# EAGLE schematic front-end-eval-boards (EAGLE 9.2.2)

## Sheet 1 of 7: Power
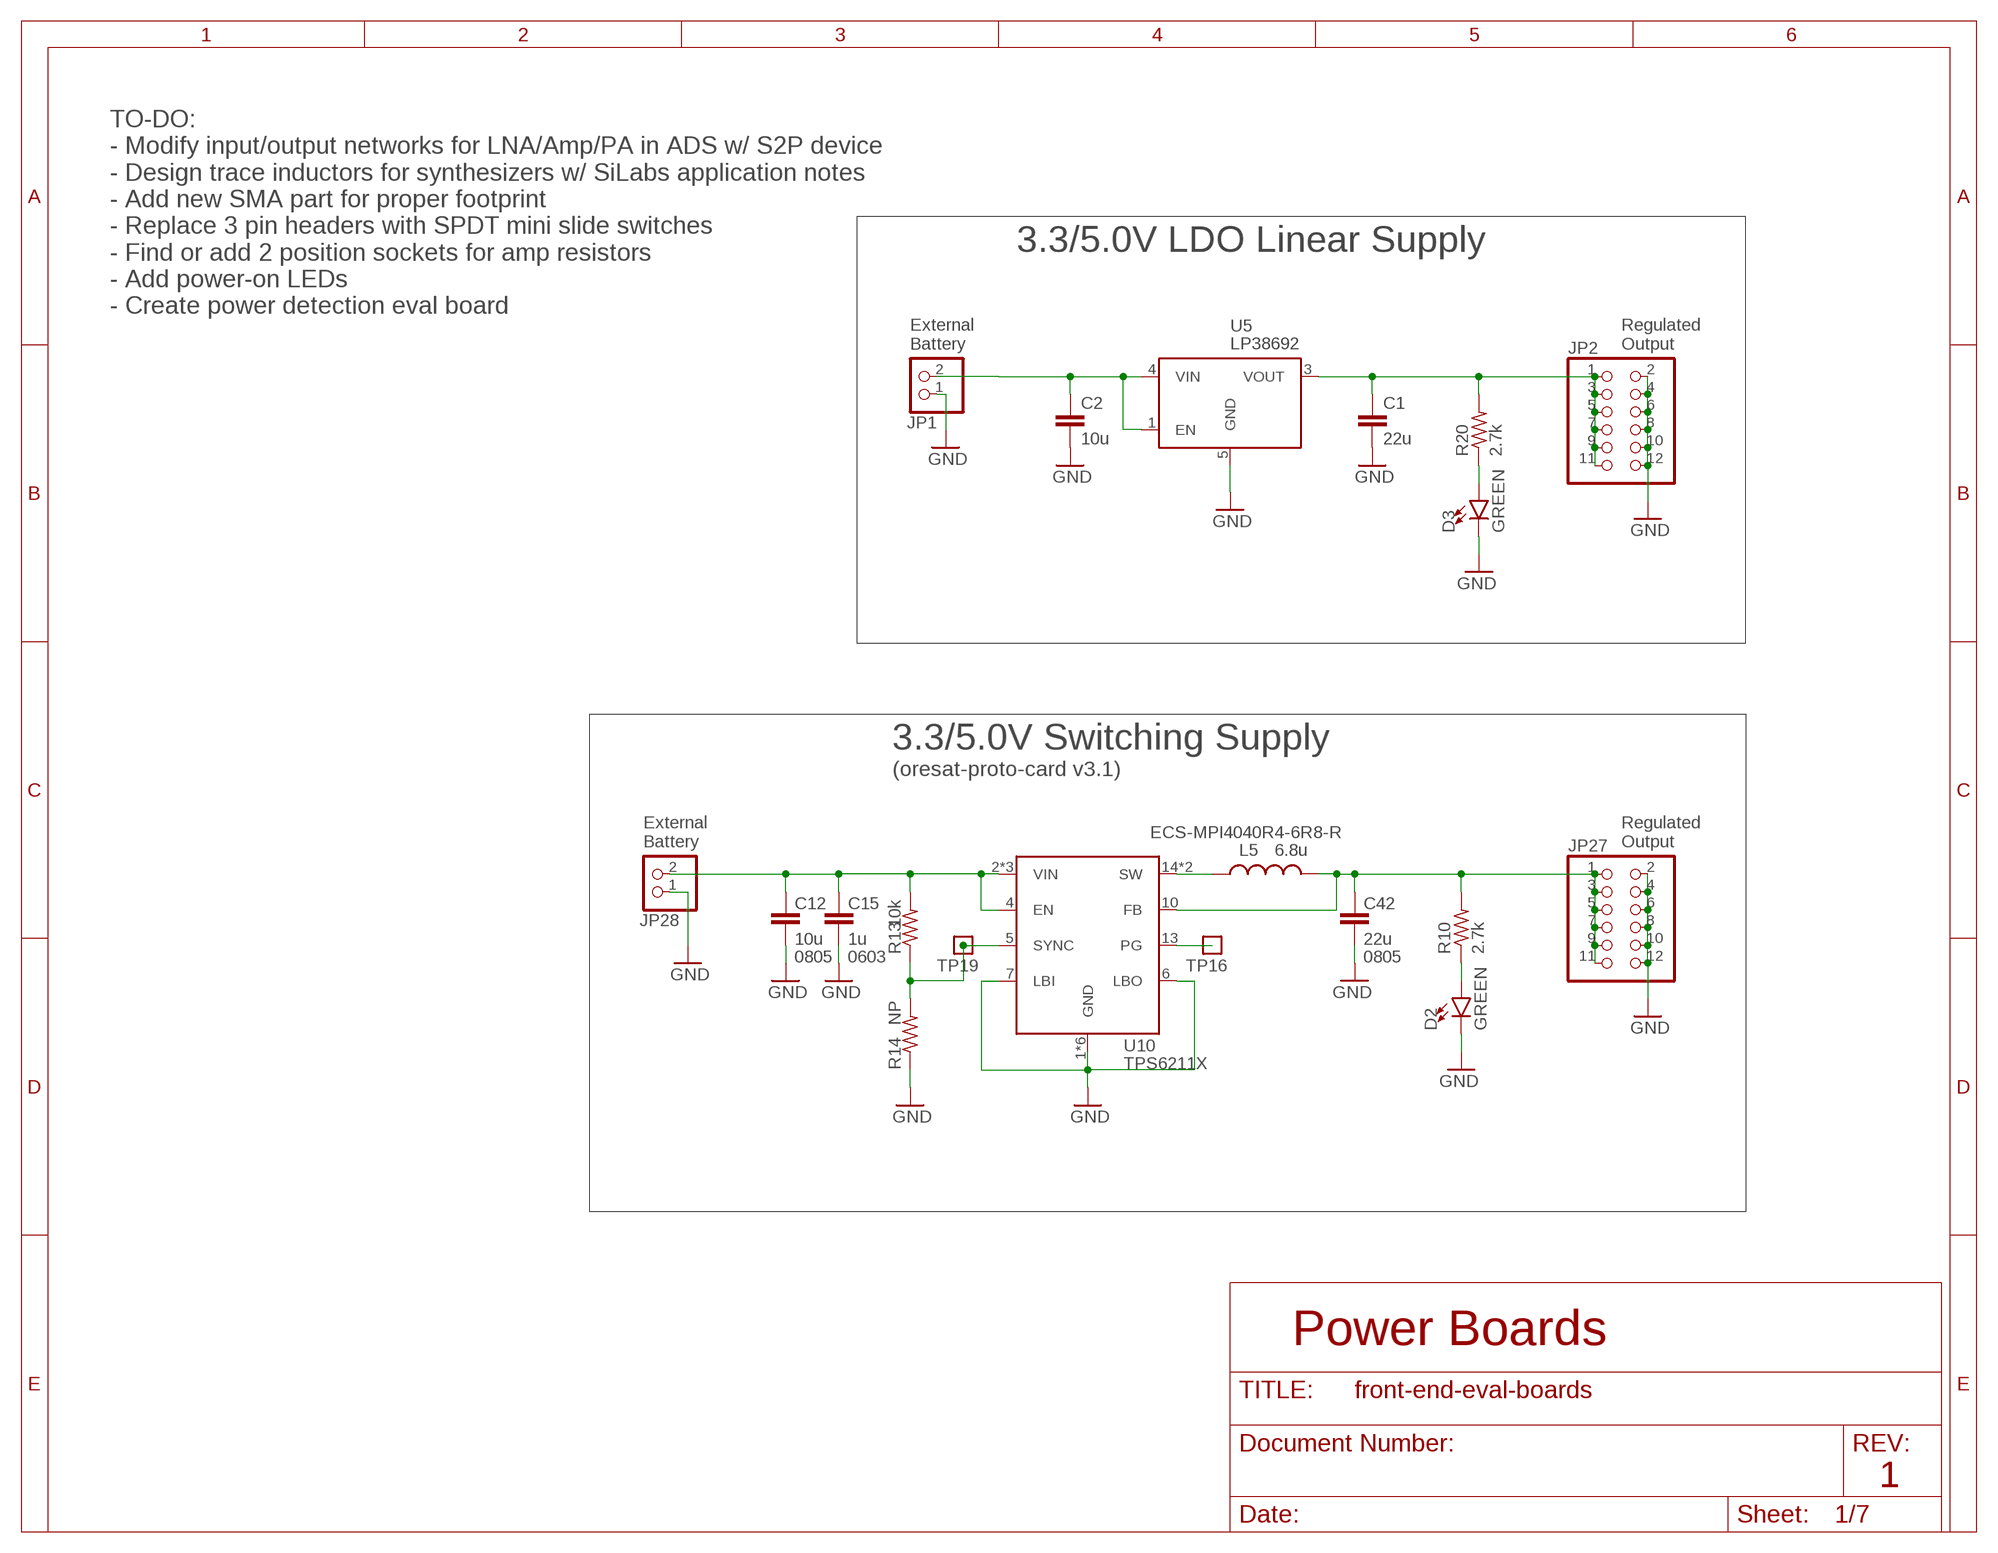
[diagram p0: schematic, sheet 1]

### Parts
C1  22u  C-EUC0603  [C0603]
C2  10u  C-EUC0603  [C0603]
C12  10u  C-EU0805-B-NOSILK  [.0805-B-NOSILK]
C15  1u  C-EU0603-B-NOSILK  [.0603-B-NOSILK]
C42  22u  C-EU0805-B-NOSILK  [.0805-B-NOSILK]
D2  GREEN  LED-GREEN0603  [LED-0603]
D3  GREEN  LED-GREEN0603  [LED-0603]
JP1  PINHD-1X2  [1X02]
JP2  PINHD-2X6  [2X06]
JP27  PINHD-2X6  [2X06]
JP28  PINHD-1X2  [1X02]
L5  6.8u  L-ECS-MPI4040  [ECS-MPI4040]
R10  2.7k  R-US_0402-B-NOSILK  [.0402-B-NOSILK]
R13  10k  R-US_0402-B-NOSILK  [.0402-B-NOSILK]
R14  NP  R-US_0402-B-NOSILK  [.0402-B-NOSILK]
R20  2.7k  R-US_0402-B-NOSILK  [.0402-B-NOSILK]
TP16  TEST-POINT  [2MM-TEST-POINT]
TP19  TEST-POINT  [2MM-TEST-POINT]
U5  LP38692  [SOT223-5]
U10  TPS6211X  [S-PVQFN-16]

### Nets
GND: C1.2 C2.2 C12.2 C15.2 C42.2 D2.C D3.C JP1.1 JP2.2 JP2.4 JP2.6 JP2.8 JP2.10 JP2.12 JP27.2 JP27.4 JP27.6 JP27.8 JP27.10 JP27.12 JP28.1 R14.1 U5.5(GND) U10.1(GND) U10.6(LBO) U10.7(LBI) U10.9(GND) U10.11(GND) U10.12(GND) U10.16(GND) U10.PAD(GND) ; also sheet 2,3,4,5,6,7
N$77: C2.1 JP1.2 U5.1(EN) U5.4(VIN)
N$78: D3.A R20.1
N$79: C42.1 JP27.1 JP27.3 JP27.5 JP27.7 JP27.9 JP27.11 L5.2 R10.2 U10.10(FB)
N$80: C12.1 C15.1 JP28.2 R13.2 U10.2(VIN) U10.3(VIN) U10.4(EN) U10.8(VIN)
N$89: C1.1 JP2.1 JP2.3 JP2.5 JP2.7 JP2.9 JP2.11 R20.2 U5.3(VOUT)
N$271: D2.A R10.1
TPS62111-PG: TP16.1 U10.13(PG)
TPS62111-SYNC: R13.1 R14.2 TP19.1 U10.5(SYNC)
TPS62111_SW: L5.1 U10.14(SW) U10.15(SW)

### Notes on the sheet
- TO-DO:
  - Modify input/output networks for LNA/Amp/PA in ADS w/ S2P device
  - Design trace inductors for synthesizers w/ SiLabs application notes
  - Add new SMA part for proper footprint
  - Replace 3 pin headers with SPDT mini slide switches
  - Find or add 2 position sockets for amp resistors
  - Add power-on LEDs
  - Create power detection eval board
- 3.3/5.0V LDO Linear Supply
- External
  Battery
- Regulated
  Output
- 3.3/5.0V Switching Supply
- (oresat-proto-card v3.1)
- ECS-MPI4040R4-6R8-R
- External
  Battery
- Regulated
  Output
- 0805 | 0603 | 0805
- Power Boards
- 1

## Sheet 2 of 7: RF Synthesizers
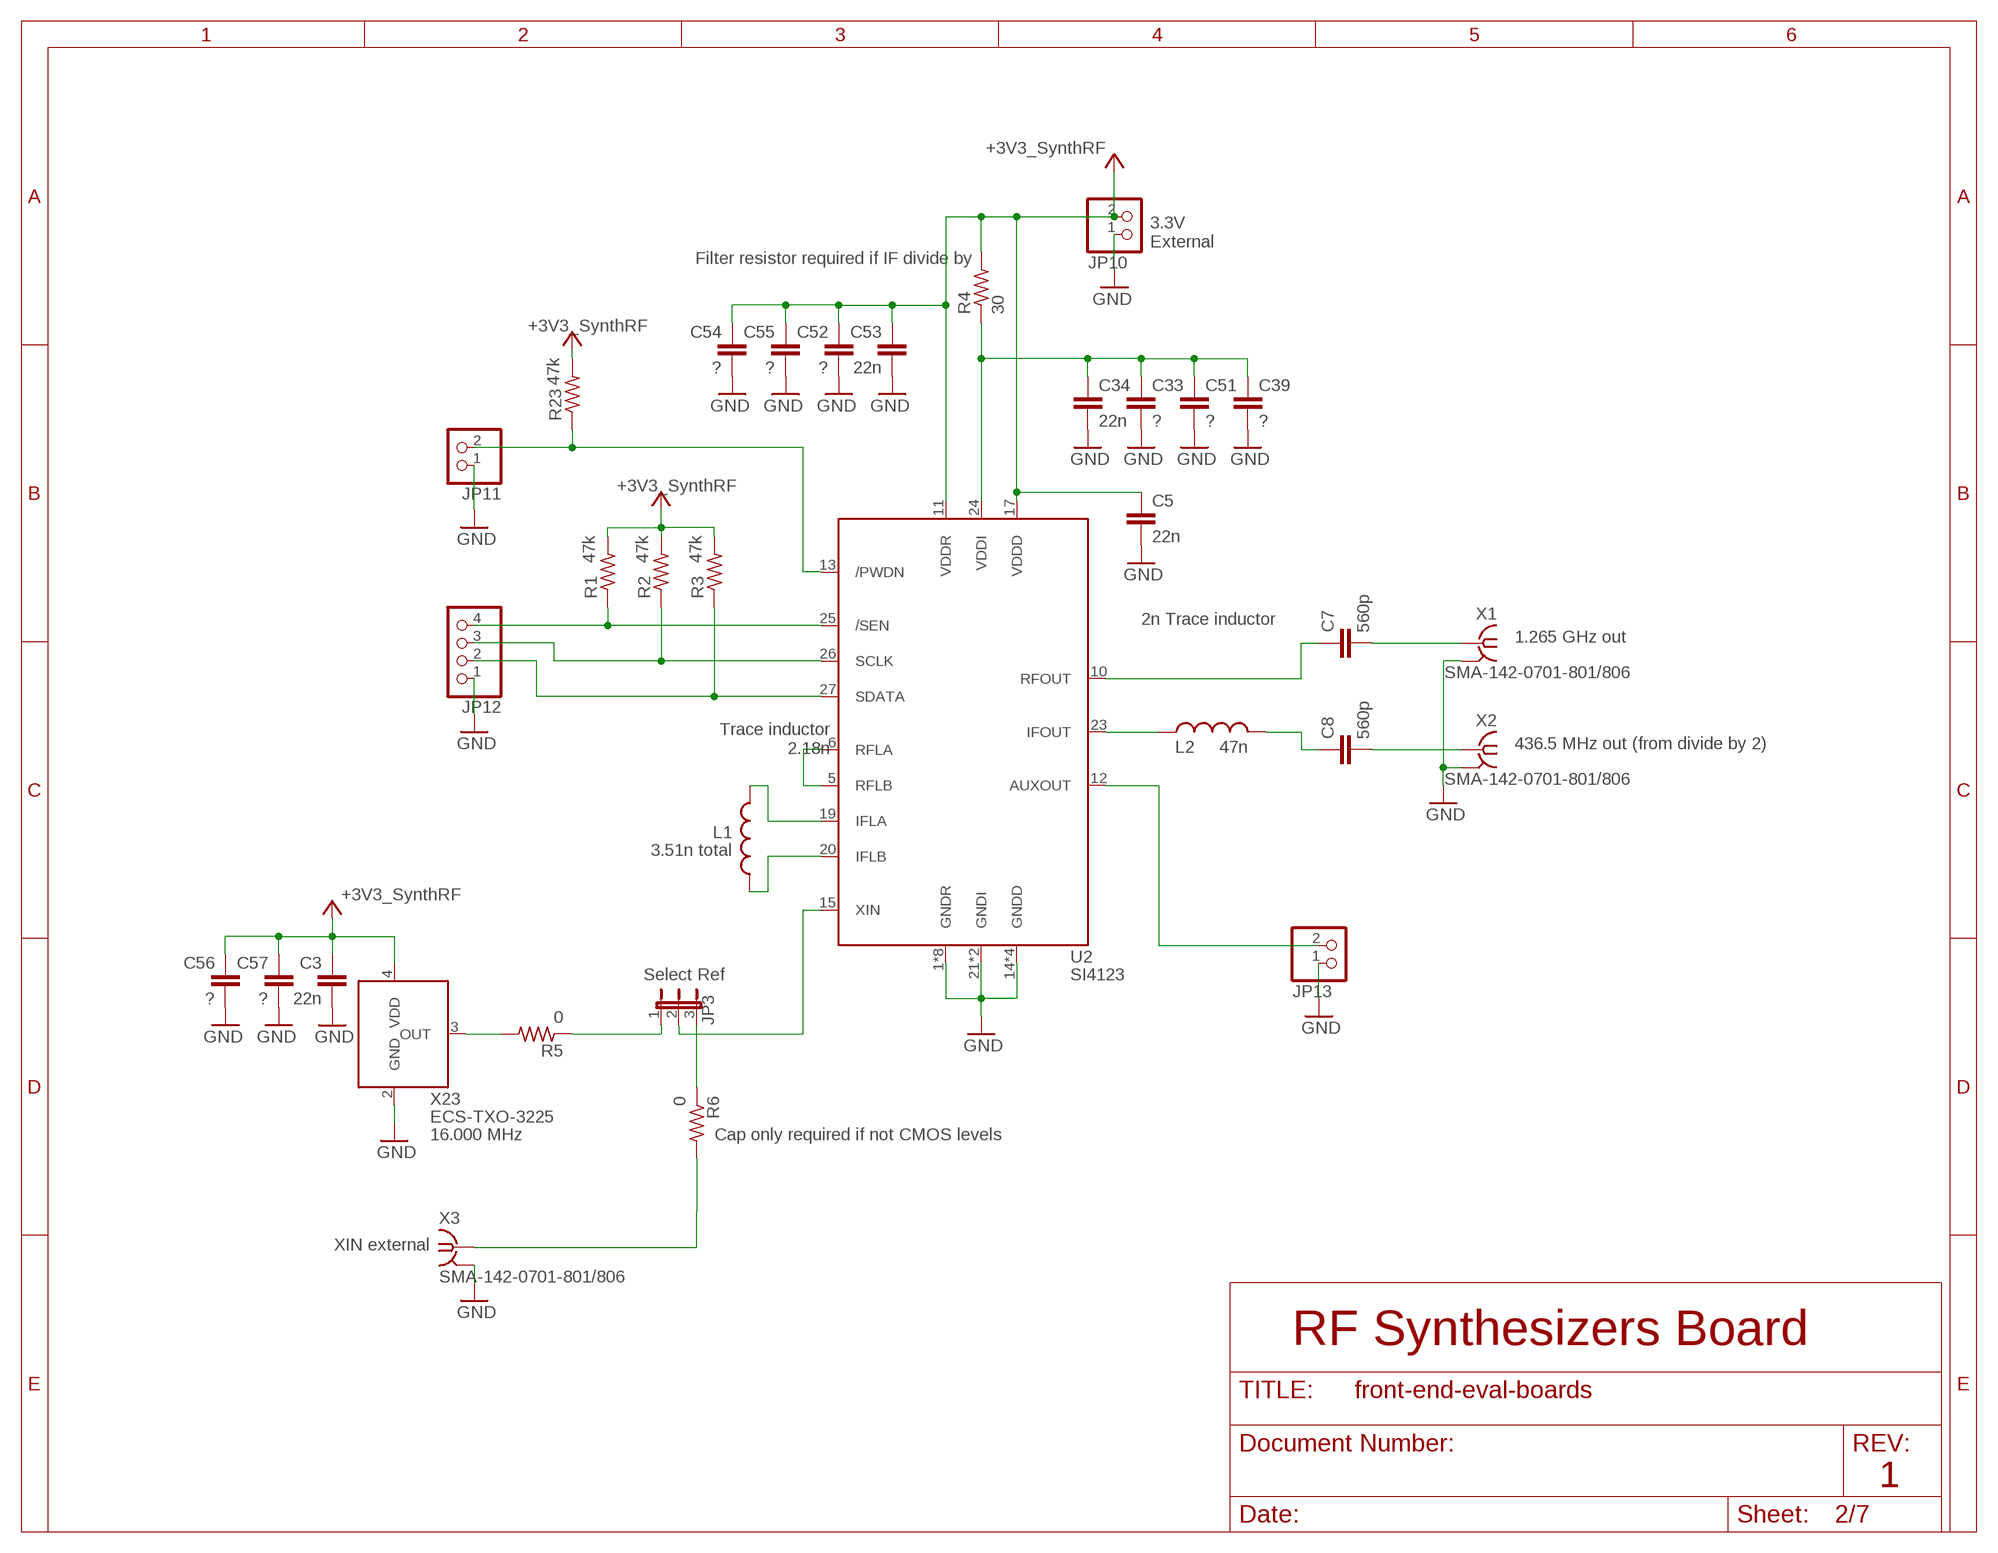
[diagram p1: schematic, sheet 2]

### Parts
C3  22n  C-EUC0603  [C0603]
C5  22n  C-EUC0603  [C0603]
C7  560p  C-EUC0402  [C0402]
C8  560p  C-EUC0402  [C0402]
C33  ?  C-EUC0603  [C0603]
C34  22n  C-EUC0603  [C0603]
C39  ?  C-EUC0603  [C0603]
C51  ?  C-EUC0603  [C0603]
C52  ?  C-EUC0603  [C0603]
C53  22n  C-EUC0603  [C0603]
C54  ?  C-EUC0603  [C0603]
C55  ?  C-EUC0603  [C0603]
C56  ?  C-EUC0603  [C0603]
C57  ?  C-EUC0603  [C0603]
JP3  JP2E  [JP2]
JP10  PINHD-1X2  [1X02]
JP11  PINHD-1X2  [1X02]
JP12  PINHD-1X4  [1X04]
JP13  PINHD-1X2  [1X02]
L1  3.51n total  L-USL0201  [L0201]
L2  47n  L-USL0201  [L0201]
R1  47k  R-US_R0402  [R0402]
R2  47k  R-US_R0402  [R0402]
R3  47k  R-US_R0402  [R0402]
R4  30  R-US_R0805  [R0805]
R5  0  R-US_R0402  [R0402]
R6  0  R-US_R0402  [R0402]
R23  47k  R-US_R0402  [R0402]
U2  SI4123  [QFN28-5X5-WITH-CENTER-PAD]
X1  SMA-142-0701-801/806  [J502-ND-142-0701-801/806]
X2  SMA-142-0701-801/806  [J502-ND-142-0701-801/806]
X3  SMA-142-0701-801/806  [J502-ND-142-0701-801/806]
X23  ECS-TXO-3225  [3.2X2.5]

### Nets
+3V3: C3.1 C5.1 C52.1 C53.1 C54.1 C55.1 C56.1 C57.1 JP10.2 R1.2 R2.2 R3.2 R4.2 R23.2 U2.11(VDDR) U2.17(VDDD) X23.4(VDD) ; supply symbol labelled +3V3_SynthRF ; also sheet 3
GND: C3.2 C5.2 C33.2 C34.2 C39.2 C51.2 C52.2 C53.2 C54.2 C55.2 C56.2 C57.2 JP10.1 JP11.1 JP12.1 JP13.1 U2.1(GNDR) U2.2(GNDR) U2.3(GNDR) U2.4(GNDR) U2.7(GNDR) U2.8(GNDR) U2.9(GNDR) U2.14(GNDD) U2.16(GNDD) U2.18(GNDD) U2.21(GNDI) U2.22(GNDI) U2.28(GNDR) U2.PAD(GNDD) X1.G@1 X1.G@2 X1.G@3 X1.G@4 X2.G@1 X2.G@2 X2.G@3 X2.G@4 X3.G@1 X3.G@2 X3.G@3 X3.G@4 X23.2(GND) ; also sheet 1,3,4,5,6,7
N$1: JP3.2 U2.15(XIN)
N$2: U2.5(RFLB) U2.6(RFLA)
N$3: L1.1 U2.19(IFLA)
N$4: JP11.2 R23.1 U2.13(/PWDN)
N$5: JP12.4 R1.1 U2.25(/SEN)
N$6: JP12.3 R2.1 U2.26(SCLK)
N$7: JP12.2 R3.1 U2.27(SDATA)
N$8: JP13.2 U2.12(AUXOUT)
N$9: JP3.1 R5.1
N$10: R6.2 X3.1
N$12: L1.2 U2.20(IFLB)
N$13: L2.1 U2.23(IFOUT)
N$14: C7.1 U2.10(RFOUT)
N$16: C7.2 X1.1
N$17: C8.1 L2.2
N$18: C8.2 X2.1
N$20: R5.2 X23.3(OUT)
N$21: JP3.3 R6.1
N$93: C33.1 C34.1 C39.1 C51.1 R4.1 U2.24(VDDI)

### Notes on the sheet
- 3.3V
  External
- Filter resistor required if IF divide by
- 2n Trace inductor
- 1.265 GHz out
- Trace inductor
        2.18n
- 436.5 MHz out (from divide by 2)
- Select Ref
- 16.000 MHz | Cap only required if not CMOS levels
- XIN external
- RF Synthesizers Board
- 1

## Sheet 3 of 7: IF Synthesizer
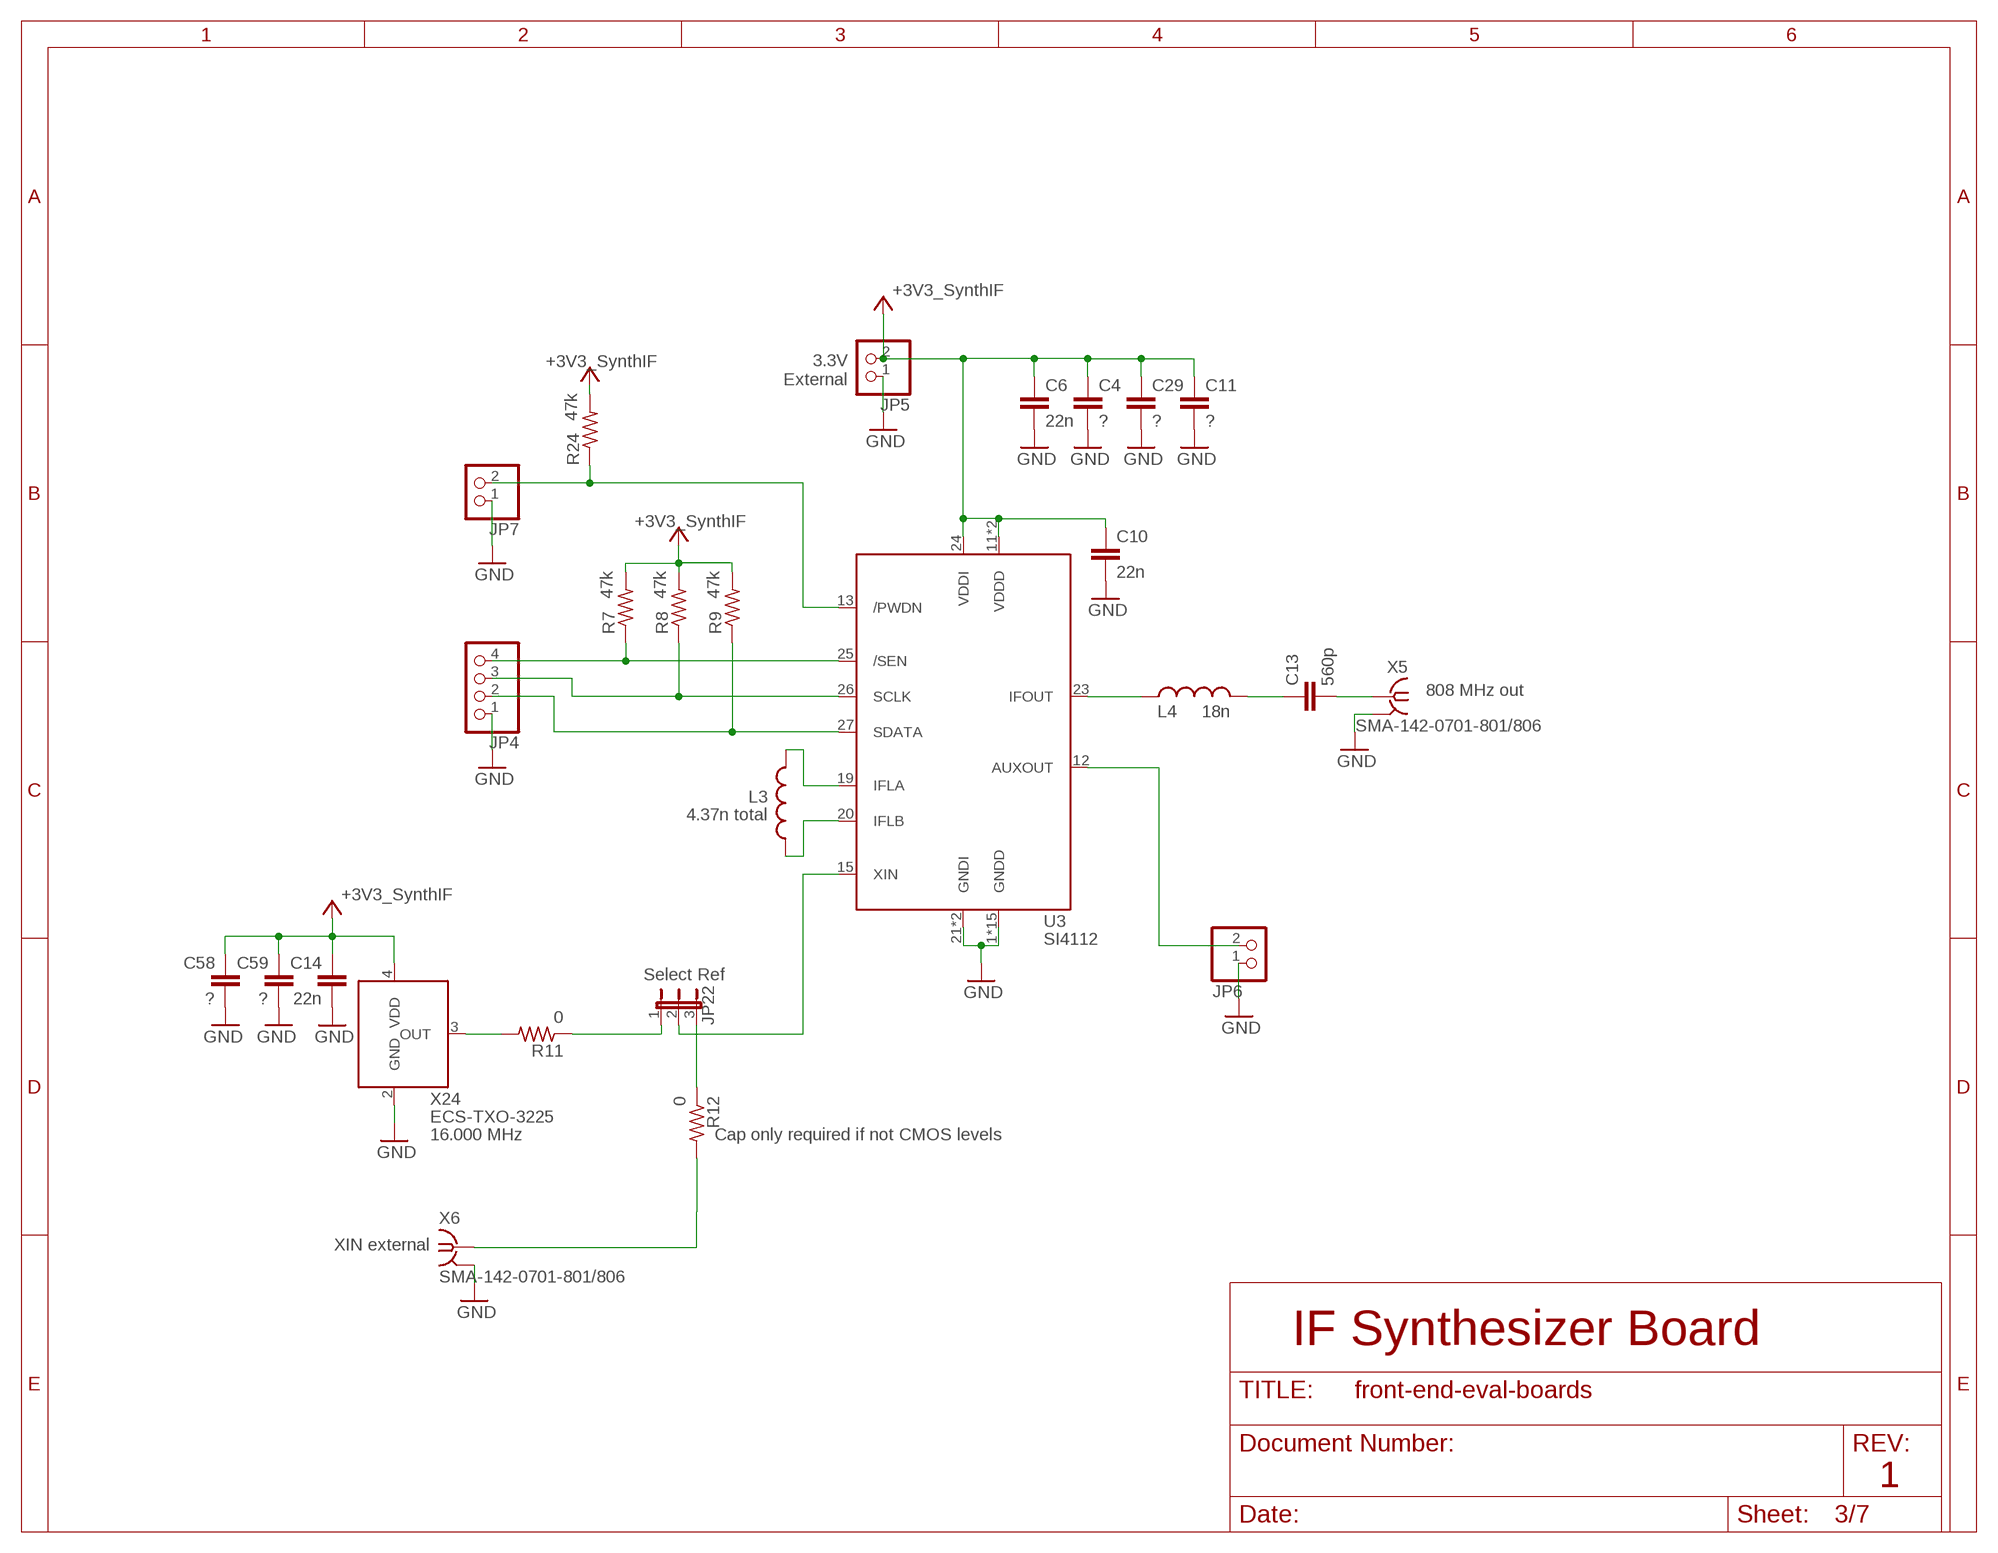
[diagram p2: schematic, sheet 3]

### Parts
C4  ?  C-EUC0603  [C0603]
C6  22n  C-EUC0603  [C0603]
C10  22n  C-EUC0603  [C0603]
C11  ?  C-EUC0603  [C0603]
C13  560p  C-EUC0402  [C0402]
C14  22n  C-EUC0603  [C0603]
C29  ?  C-EUC0603  [C0603]
C58  ?  C-EUC0603  [C0603]
C59  ?  C-EUC0603  [C0603]
JP4  PINHD-1X4  [1X04]
JP5  PINHD-1X2  [1X02]
JP6  PINHD-1X2  [1X02]
JP7  PINHD-1X2  [1X02]
JP22  JP2E  [JP2]
L3  4.37n total  L-USL0201  [L0201]
L4  18n  L-USL0201  [L0201]
R7  47k  R-US_R0402  [R0402]
R8  47k  R-US_R0402  [R0402]
R9  47k  R-US_R0402  [R0402]
R11  0  R-US_R0402  [R0402]
R12  0  R-US_R0402  [R0402]
R24  47k  R-US_R0402  [R0402]
U3  SI4112  [QFN28-5X5-WITH-CENTER-PAD]
X5  SMA-142-0701-801/806  [J502-ND-142-0701-801/806]
X6  SMA-142-0701-801/806  [J502-ND-142-0701-801/806]
X24  ECS-TXO-3225  [3.2X2.5]

### Nets
+3V2: C14.1 C58.1 C59.1 X24.4(VDD) ; supply symbol labelled +3V3_SynthIF
+3V3: C4.1 C6.1 C10.1 C11.1 C29.1 JP5.2 R7.2 R8.2 R9.2 R24.2 U3.11(VDDD) U3.17(VDDD) U3.24(VDDI) ; supply symbol labelled +3V3_SynthIF ; also sheet 2
GND: C4.2 C6.2 C10.2 C11.2 C14.2 C29.2 C58.2 C59.2 JP4.1 JP5.1 JP6.1 JP7.1 U3.1(GNDD) U3.2(GNDD) U3.3(GNDD) U3.4(GNDD) U3.5(GNDD) U3.6(GNDD) U3.7(GNDD) U3.8(GNDD) U3.9(GNDD) U3.10(GNDD) U3.14(GNDD) U3.16(GNDD) U3.18(GNDD) U3.21(GNDI) U3.22(GNDI) U3.28(GNDD) U3.PAD(GNDD) X5.G@1 X5.G@2 X5.G@3 X5.G@4 X6.G@1 X6.G@2 X6.G@3 X6.G@4 X24.2(GND) ; also sheet 1,2,4,5,6,7
N$15: L4.1 U3.23(IFOUT)
N$19: JP4.4 R7.1 U3.25(/SEN)
N$22: JP4.3 R8.1 U3.26(SCLK)
N$23: JP4.2 R9.1 U3.27(SDATA)
N$24: JP7.2 R24.1 U3.13(/PWDN)
N$25: JP6.2 U3.12(AUXOUT)
N$26: JP22.1 R11.1
N$27: R12.2 X6.1
N$29: JP22.2 U3.15(XIN)
N$30: L3.1 U3.19(IFLA)
N$31: L3.2 U3.20(IFLB)
N$35: C13.1 L4.2
N$36: C13.2 X5.1
N$37: R11.2 X24.3(OUT)
N$38: JP22.3 R12.1

### Notes on the sheet
- 3.3V
  External
- 808 MHz out
- Select Ref
- 16.000 MHz | Cap only required if not CMOS levels
- XIN external
- IF Synthesizer Board
- 1

## Sheet 4 of 7: LNAs / Amps
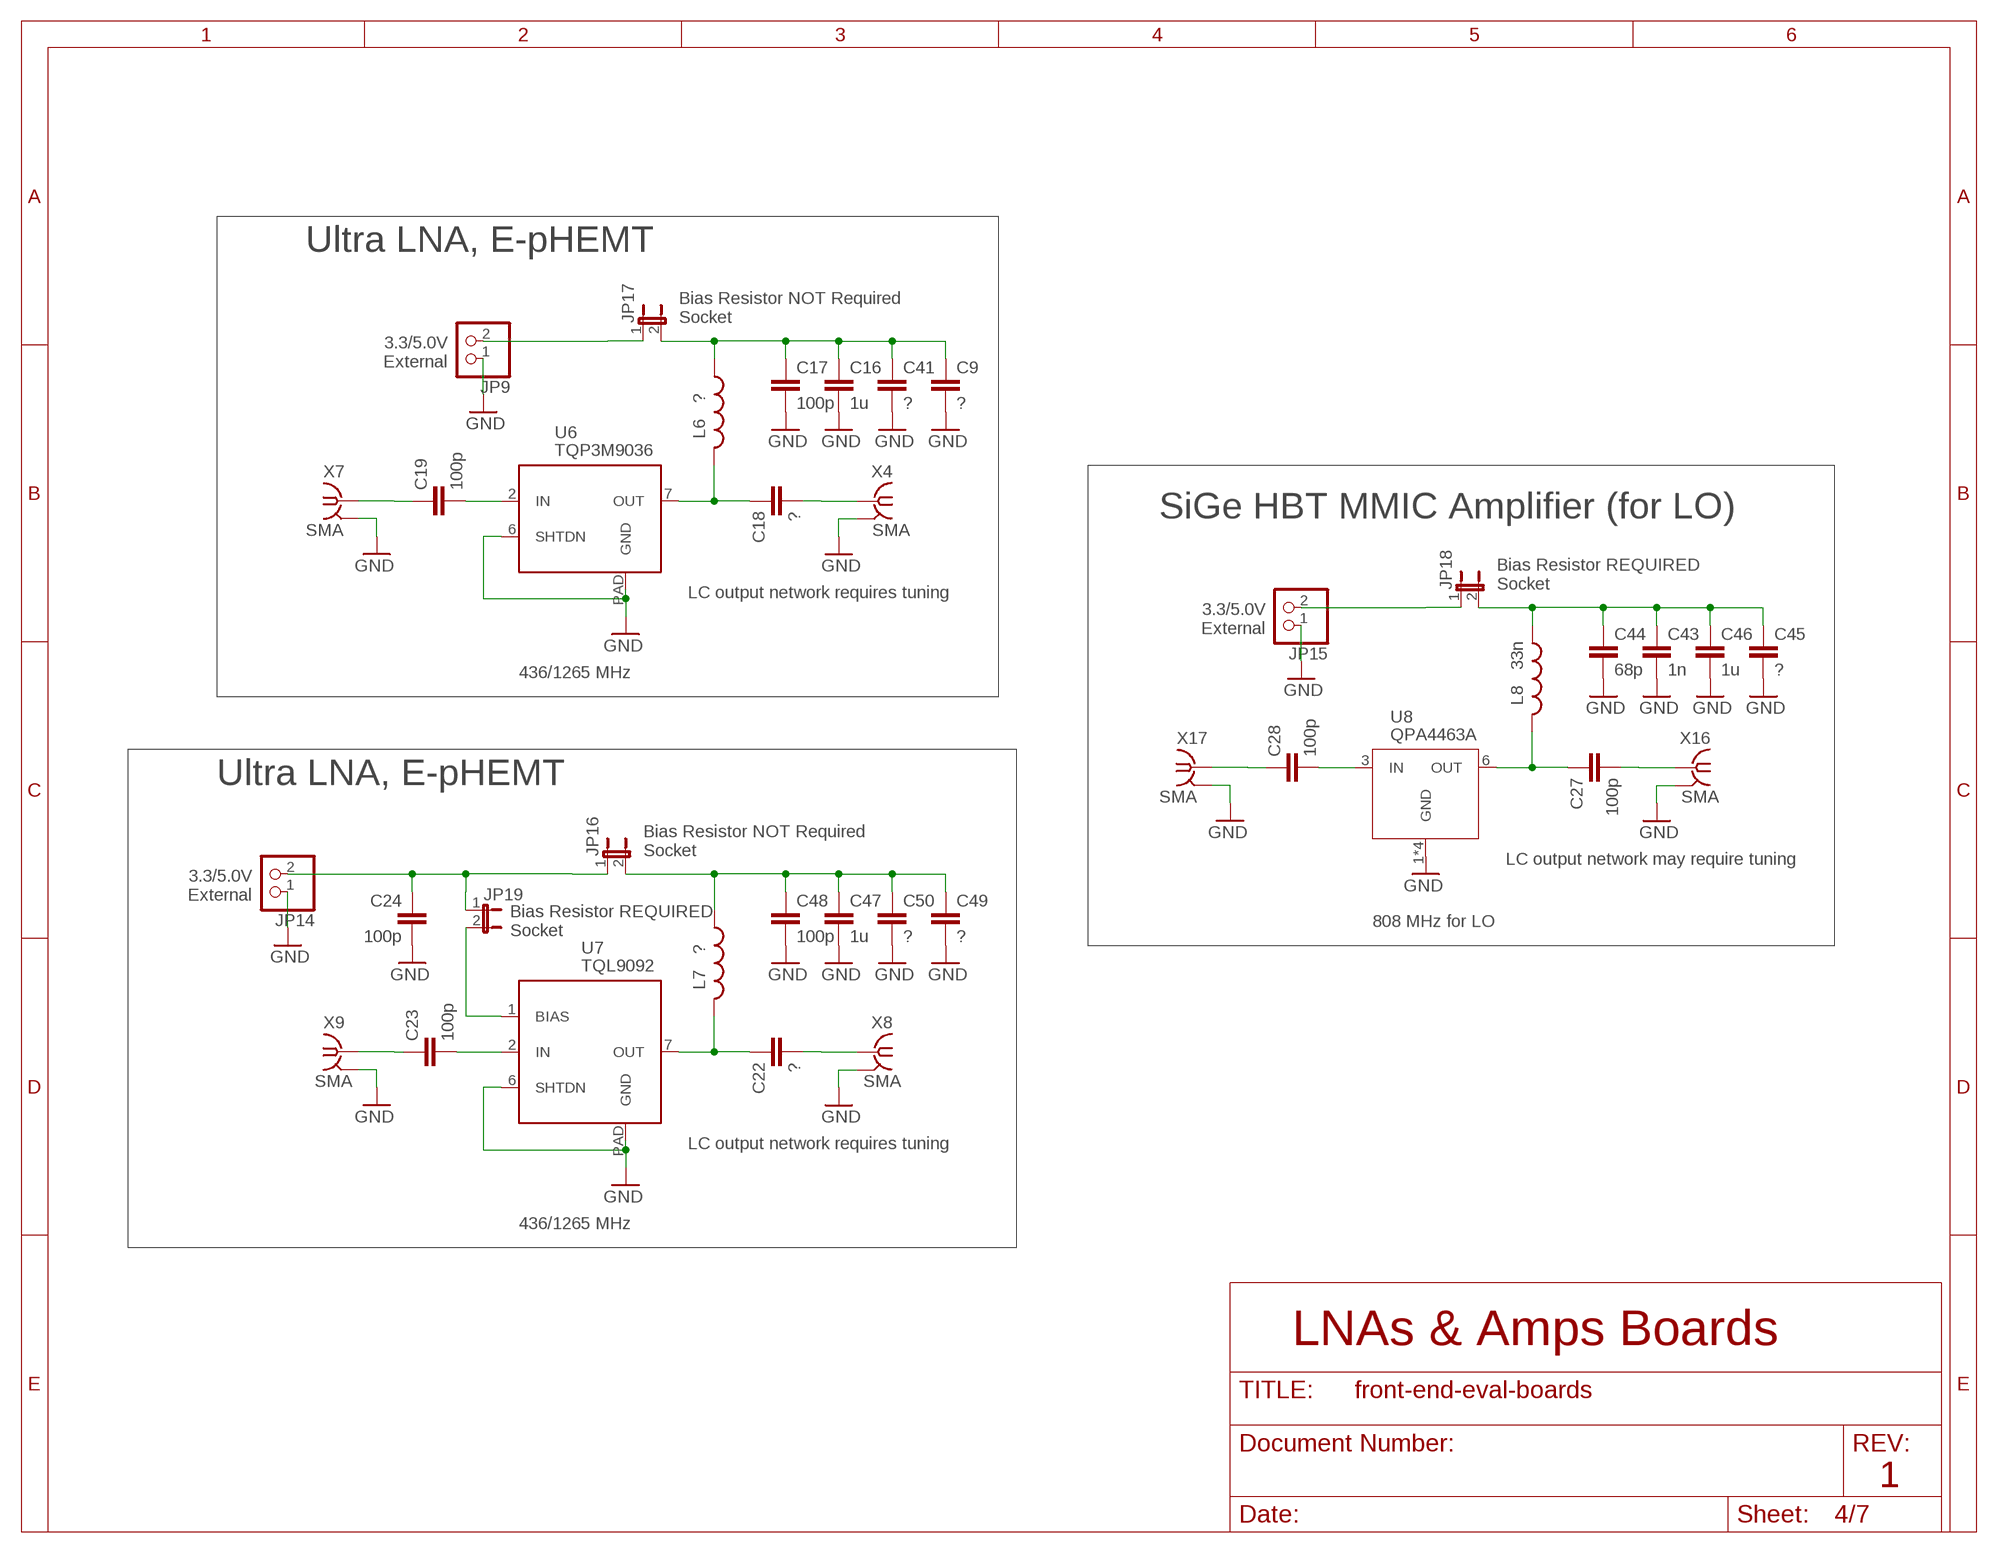
[diagram p3: schematic, sheet 4]

### Parts
C9  ?  C-EUC0603  [C0603]
C16  1u  C-EUC0603  [C0603]
C17  100p  C-EUC0603  [C0603]
C18  ?  C-EUC0603  [C0603]
C19  100p  C-EUC0603  [C0603]
C22  ?  C-EUC0603  [C0603]
C23  100p  C-EUC0603  [C0603]
C24  100p  C-EUC0603  [C0603]
C27  100p  C-EUC0603  [C0603]
C28  100p  C-EUC0603  [C0603]
C41  ?  C-EUC0603  [C0603]
C43  1n  C-EUC0603  [C0603]
C44  68p  C-EUC0603  [C0603]
C45  ?  C-EUC0603  [C0603]
C46  1u  C-EUC0603  [C0603]
C47  1u  C-EUC0603  [C0603]
C48  100p  C-EUC0603  [C0603]
C49  ?  C-EUC0603  [C0603]
C50  ?  C-EUC0603  [C0603]
JP9  PINHD-1X2  [1X02]
JP14  PINHD-1X2  [1X02]
JP15  PINHD-1X2  [1X02]
JP16  JP1E  [JP1]
JP17  JP1E  [JP1]
JP18  JP1E  [JP1]
JP19  JP1E  [JP1]
L6  ?  L-USL1812  [L1812]
L7  ?  L-USL1812  [L1812]
L8  33n  L-USL1812  [L1812]
U6  TQP3M9036  [DFN8-2X2-WITH-PAD]
U7  TQL9092  [DFN8-2X2-WITH-PAD]
U8  QPA4463A  [SOT363]
X4  SMA  SMA-142-0701-801/806  [J502-ND-142-0701-801/806]
X7  SMA  SMA-142-0701-801/806  [J502-ND-142-0701-801/806]
X8  SMA  SMA-142-0701-801/806  [J502-ND-142-0701-801/806]
X9  SMA  SMA-142-0701-801/806  [J502-ND-142-0701-801/806]
X16  SMA  SMA-142-0701-801/806  [J502-ND-142-0701-801/806]
X17  SMA  SMA-142-0701-801/806  [J502-ND-142-0701-801/806]

### Nets
GND: C9.2 C16.2 C17.2 C24.2 C41.2 C43.2 C44.2 C45.2 C46.2 C47.2 C48.2 C49.2 C50.2 JP9.1 JP14.1 JP15.1 U6.6(SHTDN) U6.PAD(GND) U7.6(SHTDN) U7.PAD(GND) U8.1(GND) U8.2(GND) U8.4(GND) U8.5(GND) X4.G@1 X4.G@2 X4.G@3 X4.G@4 X7.G@1 X7.G@2 X7.G@3 X7.G@4 X8.G@1 X8.G@2 X8.G@3 X8.G@4 X9.G@1 X9.G@2 X9.G@3 X9.G@4 X16.G@1 X16.G@2 X16.G@3 X16.G@4 X17.G@1 X17.G@2 X17.G@3 X17.G@4 ; also sheet 1,2,3,5,6,7
N$28: C18.1 L6.2 U6.7(OUT)
N$32: C19.2 U6.2(IN)
N$33: C22.1 L7.2 U7.7(OUT)
N$34: C18.2 X4.1
N$39: C19.1 X7.1
N$40: C23.2 U7.2(IN)
N$41: C22.2 X8.1
N$42: C23.1 X9.1
N$44: JP19.2 U7.1(BIAS)
N$47: C9.1 C16.1 C17.1 C41.1 JP17.2 L6.1
N$48: C47.1 C48.1 C49.1 C50.1 JP16.2 L7.1
N$53: C27.1 L8.2 U8.6(OUT)
N$54: C28.2 U8.3(IN)
N$55: C27.2 X16.1
N$56: C28.1 X17.1
N$65: JP9.2 JP17.1
N$75: C24.1 JP14.2 JP16.1 JP19.1
N$76: JP15.2 JP18.1
N$90: C43.1 C44.1 C45.1 C46.1 JP18.2 L8.1

### Notes on the sheet
- Ultra LNA, E-pHEMT
- Bias Resistor NOT Required
  Socket
- 3.3/5.0V
  External
- SiGe HBT MMIC Amplifier (for LO)
- Bias Resistor REQUIRED
  Socket
- LC output network requires tuning
- 3.3/5.0V
  External
- 436/1265 MHz
- Ultra LNA, E-pHEMT
- Bias Resistor NOT Required
  Socket
- LC output network may require tuning
- 3.3/5.0V
  External
- 808 MHz for LO
- Bias Resistor REQUIRED
  Socket
- LC output network requires tuning
- 436/1265 MHz
- LNAs & Amps Boards
- 1

## Sheet 5 of 7: PAs
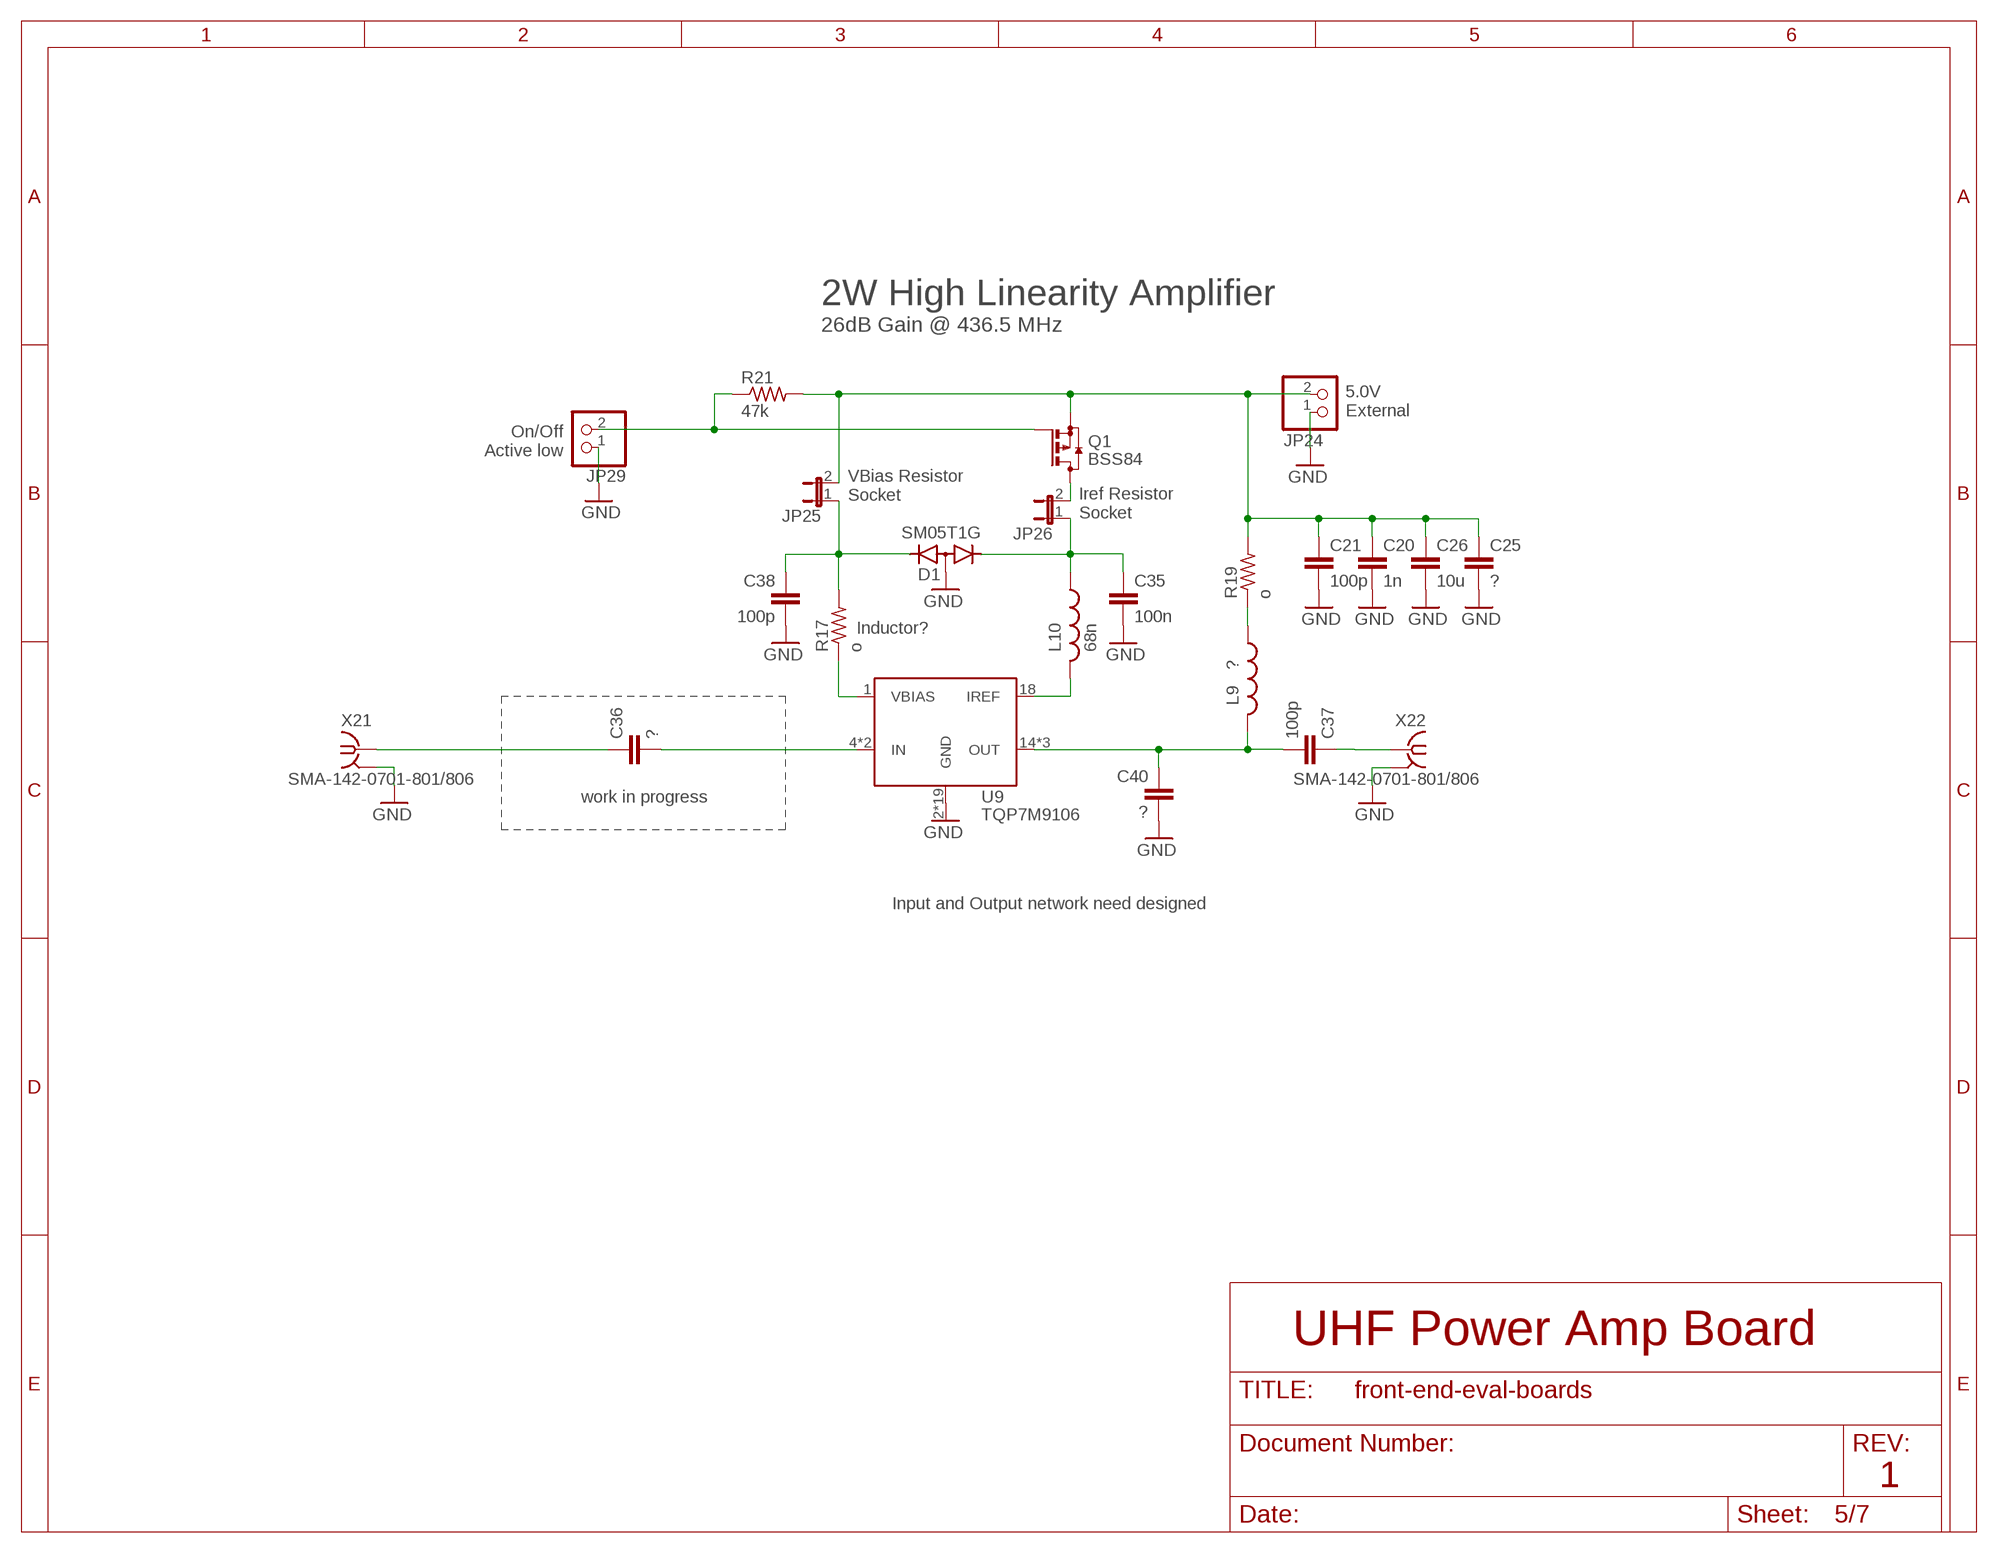
[diagram p4: schematic, sheet 5]

### Parts
C20  1n  C-EUC0603  [C0603]
C21  100p  C-EUC0603  [C0603]
C25  ?  C-EUC0603  [C0603]
C26  10u  C-EUC0603  [C0603]
C35  100n  C-EUC0603  [C0603]
C36  ?  C-EUC0603  [C0603]
C37  100p  C-EUC0603  [C0603]
C38  100p  C-EUC0603  [C0603]
C40  ?  C-EUC0603  [C0603]
D1  SM05T1G  DIODE-2CA|ACSOT23  [SOT23]
JP24  PINHD-1X2  [1X02]
JP25  JP1E  [JP1]
JP26  JP1E  [JP1]
JP29  PINHD-1X2  [1X02]
L9  ?  L-USL1812  [L1812]
L10  68n  L-USL1812  [L1812]
Q1  BSS84  [SOT23]
R17  o  R-US_R0603  [R0603]
R19  o  R-US_R0603  [R0603]
R21  47k  R-US_R0402  [R0402]
U9  TQP7M9106  [QFN24-4X4-WITH-PAD]
X21  SMA-142-0701-801/806  [J502-ND-142-0701-801/806]
X22  SMA-142-0701-801/806  [J502-ND-142-0701-801/806]

### Nets
GND: C20.2 C21.2 C25.2 C26.2 C35.2 C38.2 C40.2 D1.3(A) JP24.1 JP29.1 U9.2(GND) U9.3(GND) U9.6(GND) U9.7(GND) U9.8(GND) U9.9(GND) U9.10(GND) U9.11(GND) U9.12(GND) U9.13(GND) U9.17(GND) U9.19(GND) U9.20(GND) U9.21(GND) U9.22(GND) U9.23(GND) U9.24(GND) U9.BPAD(GND) U9.TPAD(GND) X21.G@1 X21.G@2 X21.G@3 X21.G@4 X22.G@1 X22.G@2 X22.G@3 X22.G@4 ; also sheet 1,2,3,4,6,7
N$11: JP29.2 Q1.1(G) R21.1
N$63: C36.2 U9.4(IN) U9.5(IN)
N$66: D1.2(K2) JP25.1 R17.2
N$67: C37.1 X22.1
N$68: L10.2 U9.18(IREF)
N$69: C37.2 C40.1 L9.2 U9.14(OUT) U9.15(OUT) U9.16(OUT)
N$70: C35.1 D1.1(K1) JP26.1 L10.1
N$71: C38.1
N$72: C20.1 C21.1 C25.1 C26.1 JP24.2 JP25.2 Q1.2(S) R19.2 R21.2
N$73: R17.1 U9.1(VBIAS)
N$74: L9.1 R19.1
N$84: C36.1 X21.1
N$91: JP26.2 Q1.3(D)

### Notes on the sheet
- 2W High Linearity Amplifier
- 26dB Gain @ 436.5 MHz
- 5.0V
  External
- On/Off
  Active low
- VBias Resistor
  Socket
- Iref Resistor
  Socket
- Inductor?
- work in progress
- Input and Output network need designed
- UHF Power Amp Board
- 1

## Sheet 6 of 7: Mixer / Quad. / Switch
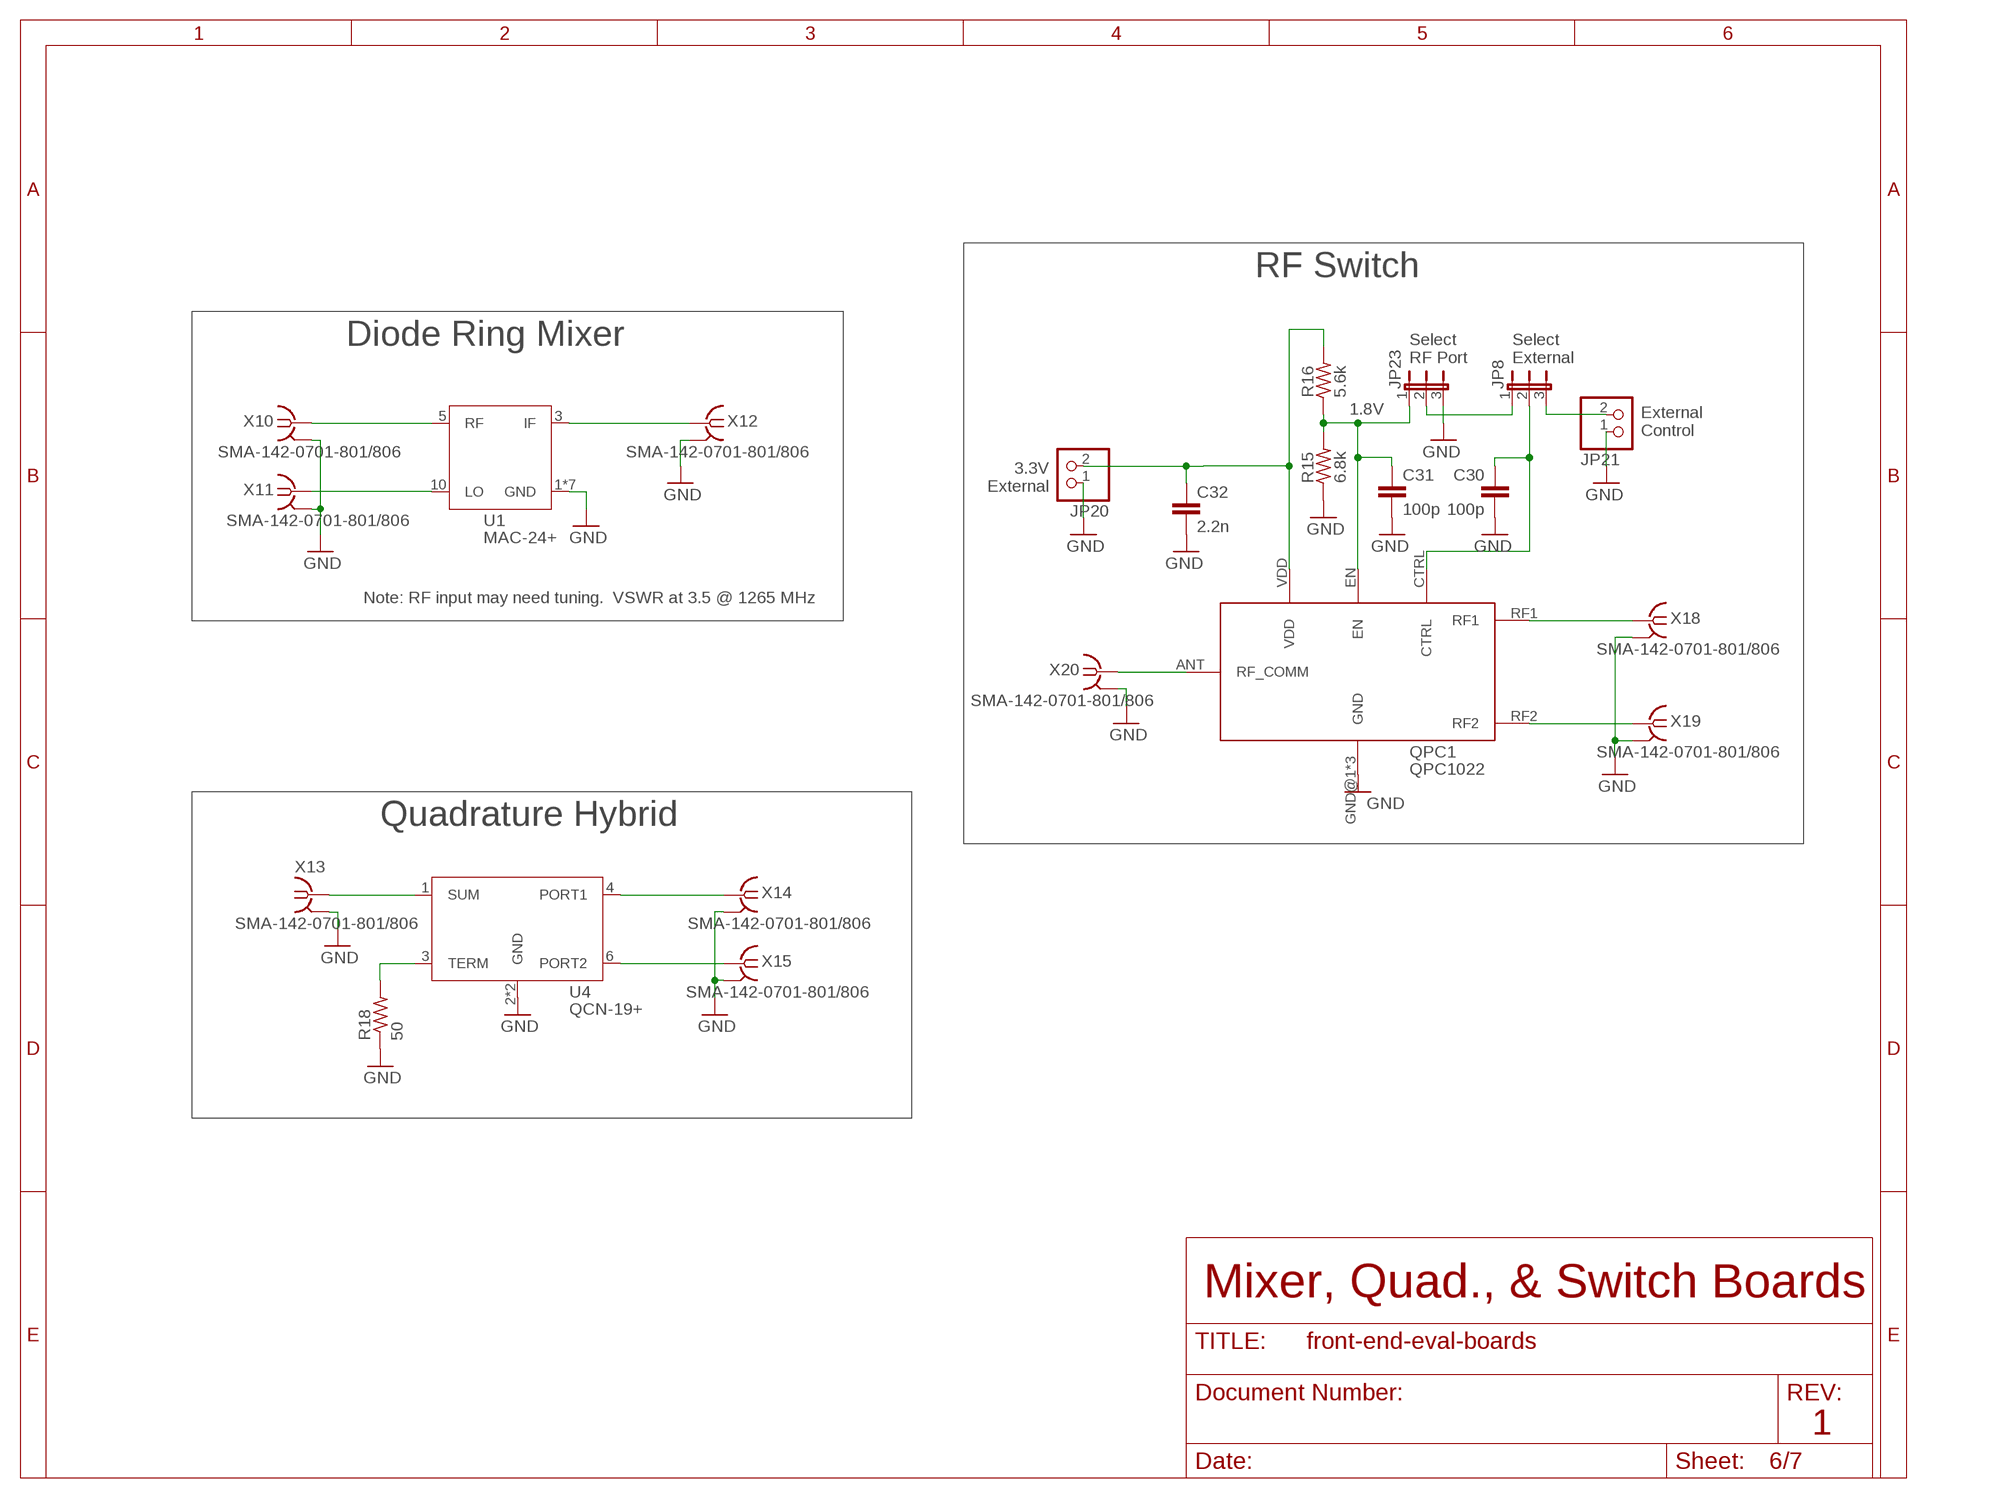
[diagram p5: schematic, sheet 6]

### Parts
C30  100p  C-EUC0402  [C0402]
C31  100p  C-EUC0402  [C0402]
C32  2.2n  C-EUC0603  [C0603]
JP8  JP2E  [JP2]
JP20  PINHD-1X2  [1X02]
JP21  PINHD-1X2  [1X02]
JP23  JP2E  [JP2]
QPC1  QPC1022  [QPC1022]
R15  6.8k  R-US_R0402  [R0402]
R16  5.6k  R-US_R0402  [R0402]
R18  50  R-US_R0603  [R0603]
U1  MAC-24+  [MAC-24+]
U4  QCN-19+  [QCN-19+]
X10  SMA-142-0701-801/806  [J502-ND-142-0701-801/806]
X11  SMA-142-0701-801/806  [J502-ND-142-0701-801/806]
X12  SMA-142-0701-801/806  [J502-ND-142-0701-801/806]
X13  SMA-142-0701-801/806  [J502-ND-142-0701-801/806]
X14  SMA-142-0701-801/806  [J502-ND-142-0701-801/806]
X15  SMA-142-0701-801/806  [J502-ND-142-0701-801/806]
X18  SMA-142-0701-801/806  [J502-ND-142-0701-801/806]
X19  SMA-142-0701-801/806  [J502-ND-142-0701-801/806]
X20  SMA-142-0701-801/806  [J502-ND-142-0701-801/806]

### Nets
GND: C30.2 C31.2 C32.2 JP20.1 JP21.1 JP23.3 QPC1.GND@1(GND) QPC1.GND@2(GND) QPC1.GND@3(GND) R15.1 R18.1 U1.1(GND) U1.2(GND) U1.4(GND) U1.6(GND) U1.7(GND) U1.8(GND) U1.9(GND) U4.2(GND) U4.5(GND) X10.G@1 X10.G@2 X10.G@3 X10.G@4 X11.G@1 X11.G@2 X11.G@3 X11.G@4 X12.G@1 X12.G@2 X12.G@3 X12.G@4 X13.G@1 X13.G@2 X13.G@3 X13.G@4 X14.G@1 X14.G@2 X14.G@3 X14.G@4 X15.G@1 X15.G@2 X15.G@3 X15.G@4 X18.G@1 X18.G@2 X18.G@3 X18.G@4 X19.G@1 X19.G@2 X19.G@3 X19.G@4 X20.G@1 X20.G@2 X20.G@3 X20.G@4 ; also sheet 1,2,3,4,5,7
N$43: U1.5(RF) X10.1
N$45: U1.10(LO) X11.1
N$46: U1.3(IF) X12.1
N$49: R18.2 U4.3(TERM)
N$50: U4.1(SUM) X13.1
N$51: U4.4(PORT1) X14.1
N$52: U4.6(PORT2) X15.1
N$58: QPC1.ANT(RF_COMM) X20.1
N$59: QPC1.RF1 X18.1
N$60: QPC1.RF2 X19.1
N$61: JP8.3 JP21.2
N$62: C30.1 JP8.2 QPC1.CTRL
N$64: JP8.1 JP23.2
N$81: C31.1 JP23.1 QPC1.EN R15.2 R16.1
N$82: C32.1 JP20.2 QPC1.VDD R16.2

### Notes on the sheet
- RF Switch
- Diode Ring Mixer
- Select
  RF Port
- Select
  External
- External
  Control
- 1.8V
- 3.3V
  External
- Note: RF input may need tuning.  VSWR at 3.5 @ 1265 MHz
- Quadrature Hybrid
- Mixer, Quad., & Switch Boards
- 1

## Sheet 7 of 7: Filters / Pwr. Detectors
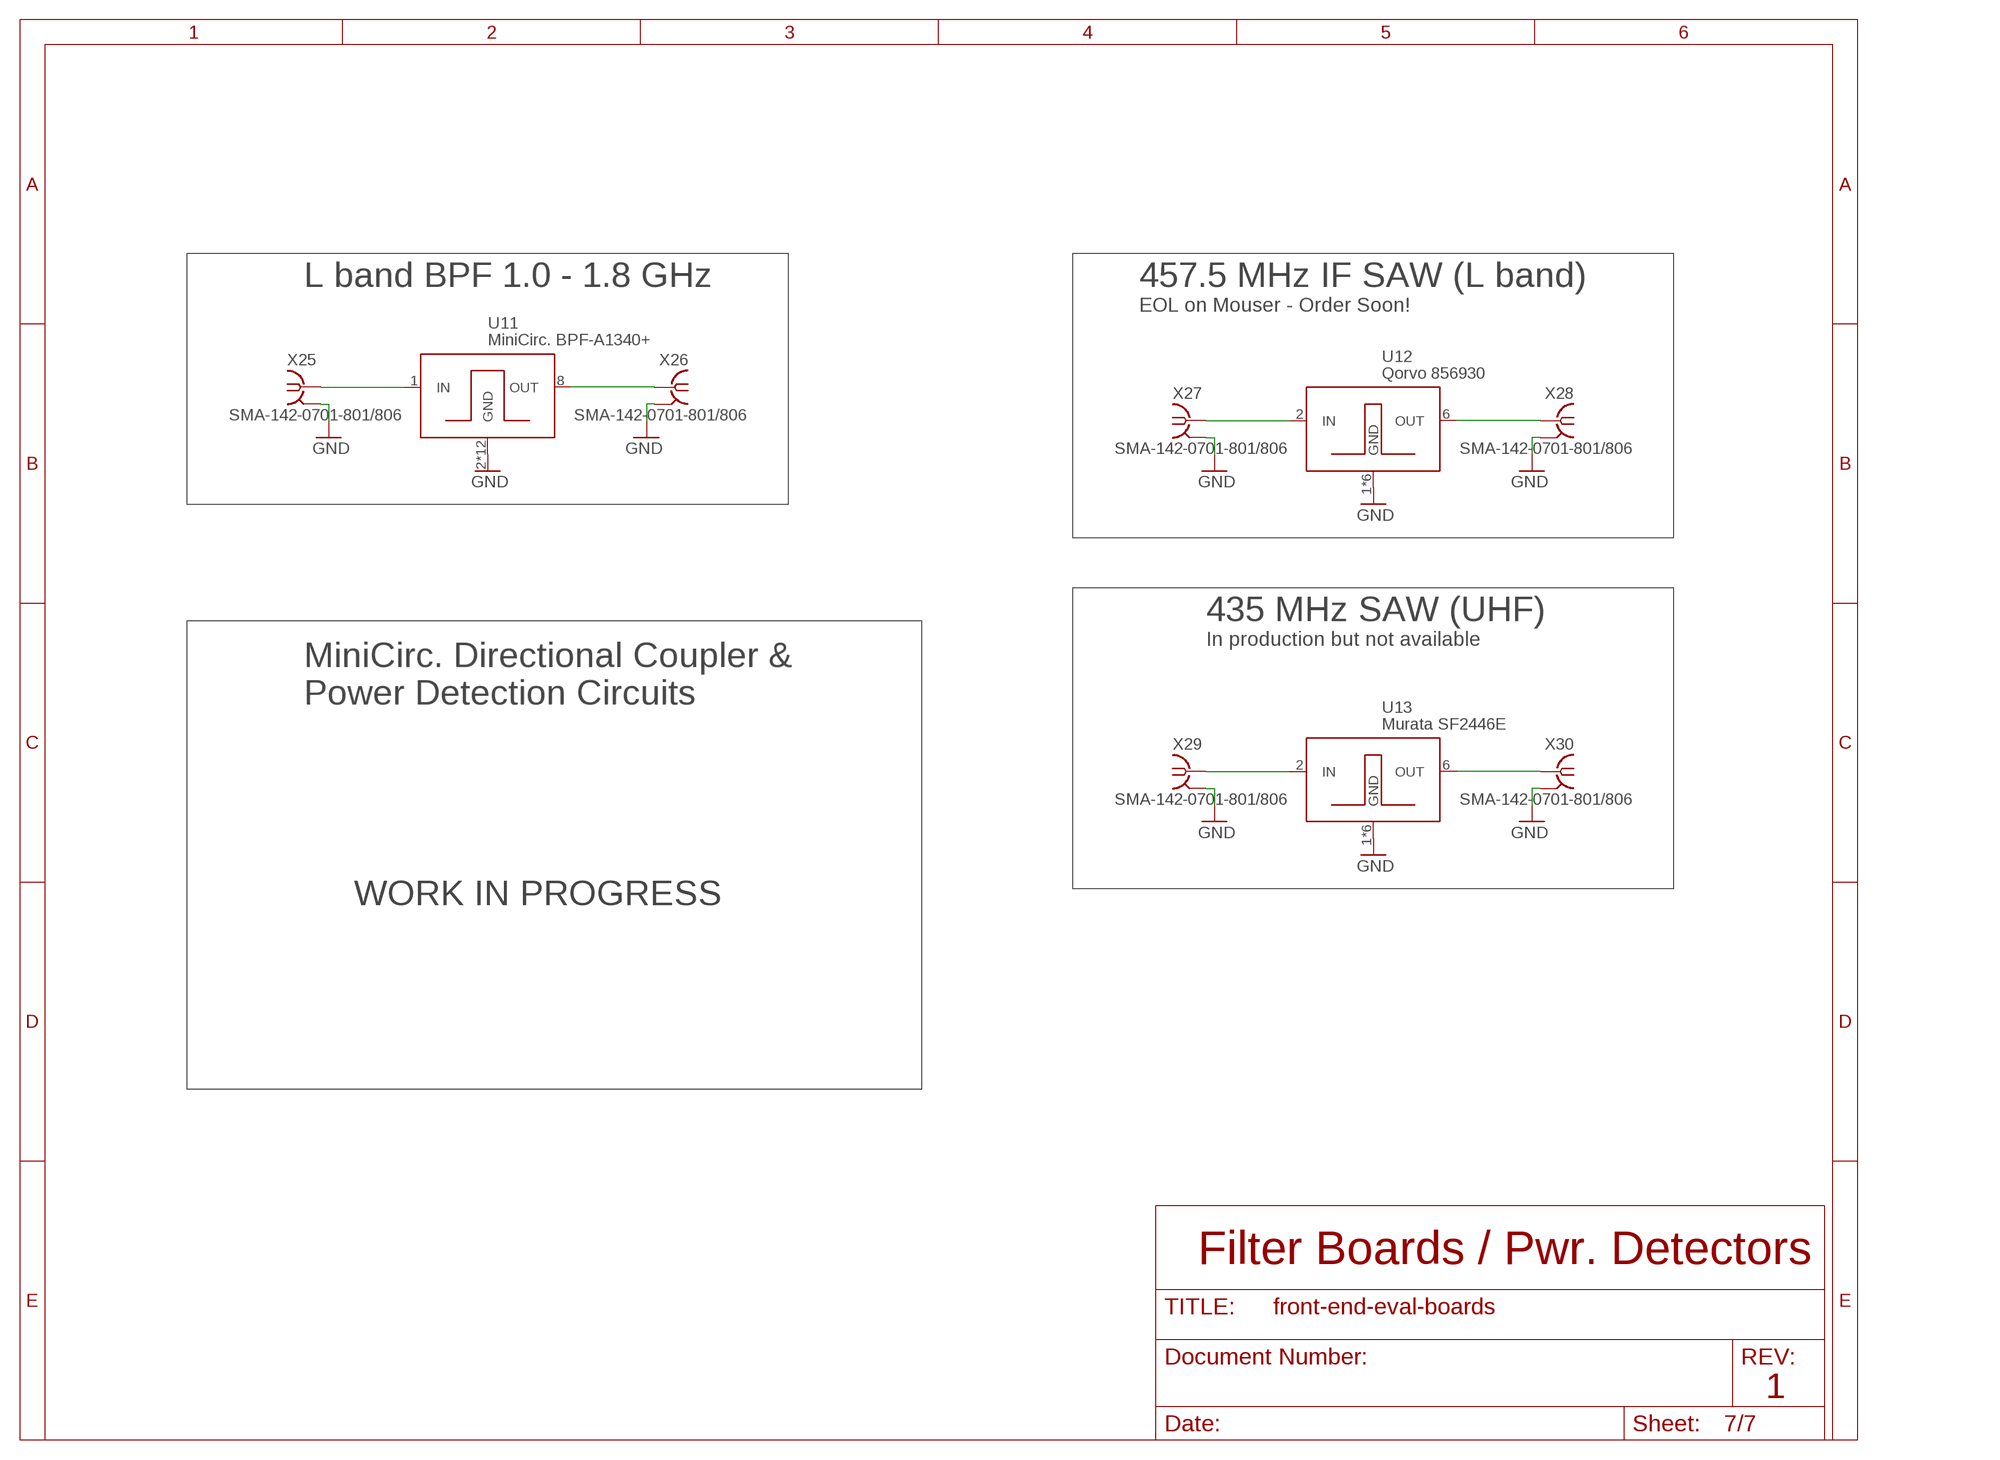
[diagram p6: schematic, sheet 7]

### Parts
U11  MiniCirc. BPF-A1340+  BPF-A1340+  [BPF-A1340+]
U12  Qorvo 856930  856930  [3.8X3.8]
U13  Murata SF2446E  856930  [3.8X3.8]
X25  SMA-142-0701-801/806  [J502-ND-142-0701-801/806]
X26  SMA-142-0701-801/806  [J502-ND-142-0701-801/806]
X27  SMA-142-0701-801/806  [J502-ND-142-0701-801/806]
X28  SMA-142-0701-801/806  [J502-ND-142-0701-801/806]
X29  SMA-142-0701-801/806  [J502-ND-142-0701-801/806]
X30  SMA-142-0701-801/806  [J502-ND-142-0701-801/806]

### Nets
GND: U11.2(GND) U11.3(GND) U11.4(GND) U11.5(GND) U11.6(GND) U11.7(GND) U11.9(GND) U11.10(GND) U11.11(GND) U11.12(GND) U11.13(GND) U11.14(GND) U12.1(GND) U12.3(GND) U12.4(GND) U12.5(GND) U12.7(GND) U12.8(GND) U13.1(GND) U13.3(GND) U13.4(GND) U13.5(GND) U13.7(GND) U13.8(GND) X25.G@1 X25.G@2 X25.G@3 X25.G@4 X26.G@1 X26.G@2 X26.G@3 X26.G@4 X27.G@1 X27.G@2 X27.G@3 X27.G@4 X28.G@1 X28.G@2 X28.G@3 X28.G@4 X29.G@1 X29.G@2 X29.G@3 X29.G@4 X30.G@1 X30.G@2 X30.G@3 X30.G@4 ; also sheet 1,2,3,4,5,6
N$57: U13.2(IN) X29.1
N$83: U11.1(IN) X25.1
N$85: U11.8(OUT) X26.1
N$86: U12.2(IN) X27.1
N$87: U12.6(OUT) X28.1
N$88: U13.6(OUT) X30.1

### Notes on the sheet
- L band BPF 1.0 - 1.8 GHz | 457.5 MHz IF SAW (L band)
- EOL on Mouser - Order Soon!
- 435 MHz SAW (UHF)
- In production but not available
- MiniCirc. Directional Coupler &
  Power Detection Circuits
- WORK IN PROGRESS
- Filter Boards / Pwr. Detectors
- 1

## Library data of the parts
C1-C11 C13 C14 C16-C41 C43-C59 = rcl:C-EU: CAPACITOR, European symbol; SPICEPREFIX: C
C12 C42 = oresat-rcl:C-EU: CAPACITOR, European symbol
C15 = oresat-rcl:C-EU: CAPACITOR, European symbol; DIS: Digi-Key; DPN: 1276-1001-1-ND; MFR: Samsung; MPN: CL05B104KO5NNNC
D1 = diode:DIODE-2CA|AC: Dual DIODE Cathode-Anode|Anode-Cathode
D2 D3 = SparkFun-LED:LED-GREEN: Green SMD LED Used in manufacturing of various products at SparkFun Packages: 0603 - SMD 0603 package [Product Link] <http://www.futureelectronics.com/en/technologies/semiconductors/optoelectronics/leds/Pages/9894312-LTST-C190GKT.aspx?CrossPart=HSMG-C190&IM=0> LilyPad 1206 - SMD1206 LilyPad package [Product Link] <http://www.futureelectronics.com/en/Technologies/Product.aspx?ProductID=IN150NGHARVATEKCORPORATION2049943&IM=0> 1206 - SMD1206 package [Product Link] <http://www.futureelectronics.com/en/technologies/semiconductors/optoelectronics/leds/Pages/8315665-LTST-C150KGKT.aspx?IM=0> 1206 Bottom Mount -SMD 1206 Bottom Mount [Product Link] <http://www.digikey.com/product-detail/en/lite-on-inc/LTST-C230KGKT/160-1456-1-ND/386854> SparkFun Products: Pro Mini 328 -5V <https://www.sparkfun.com/products/821> RedBoard <https://www.sparkfun.com/products/12757> MP3 Trigger <https://www.sparkfun.com/products/13720> Makey Makey <https://www.sparkfun.com/products/11076>
JP1 JP5-JP7 JP9-JP11 JP13-JP15 JP20 JP21 JP24 JP28 JP29 = pinhead:PINHD-1X2: PIN HEADER
JP2 JP27 = pinhead:PINHD-2X6: PIN HEADER
JP3 JP8 JP22 JP23 = jumper:JP2E: JUMPER
JP4 JP12 = pinhead:PINHD-1X4: PIN HEADER
JP16-JP19 JP25 JP26 = jumper:JP1E: JUMPER
L1-L4 L6-L10 = rcl:L-US: INDUCTOR, American symbol; SPICEPREFIX: L
L5 = L-ECS-MPI4040:L-ECS-MPI4040; MFR: ECS; MPN: ECS-MPI4040R4-6R8-R
Q1 = transistor-small-signal:BSS84: P-CHANNEL MOS FET
QPC1 = U-Qorvo-QPC1022-RF-SPDT-switch:QPC1022
R1-R9 R11 R12 R15-R19 R21 R23 R24 = rcl:R-US_: RESISTOR, American symbol; SPICEPREFIX: R
R10 R13 R14 R20 = rcl_custom:R-US_: RESISTOR, American symbol; DIS: Digi-Key; DPN: 1276-4275-1-ND; MFR: Samsung; MPN: RC1005F6653CS
TP16 TP19 = Tova:TEST-POINT
U1 = U-MiniCirc-Mac-24+-mixer:MAC-24+: RF Mixer, Diode Ring, 0.3 - 12 GHz
U2 = U-Silicon-Labs-Si4133-synthesizer:SI4123: RF Synthesizer w/ integrated VCOs (RF1/IF OUT)
U3 = U-Silicon-Labs-Si4133-synthesizer:SI4112: RF Synthesizer w/ integrated VCOs (IF OUT)
U4 = U-MiniCirc-QCN-19+-quad:QCN-19+: RF Power Splitter/Combiner, Quadrature, 1.1 - 1.925 GHz
U5 = U-TI-LP38692-linear-reg:LP38692: 1A LDO Linear Regulator
U6 = U-Qorvo-TQP3M9036-LNA:TQP3M9036: Ultra Low Noise, High Linearity LNA, 0.1 - 2.0 GHz
U7 = U-Qorvo-TQL9092-LNA:TQL9092: Ultra Low Noise, Flat Gain LNA, 0.6 - 4.2 GHz
U8 = U-Qorvo-QPA4463A-amp:QPA4463A: DC - 3.5 GHz High Performance Amplifier
U9 = U-Qorvo-TQP7M9106-PA:TQP7M9106: 2W High Linearity RF Amplifier, 50 - 1500 MHz
U10 = U-TI-TPS6211x-SPS-buck:TPS6211X: TPS6211x 17-V, 1.5-A, Synchronous Step-Down Converter; MFR: TI; MPN: TPS62111RSA
U11 = U-MiniCirc-BPF-A1340+-BPF:BPF-A1340+: 1.0 - 1.8 GHz Bandpass Filter
U12 U13 = U-Qorvo-856930-SAW:856930: 457.5 MHz SAW Filter
X1-X22 X25-X30 = con-coax:SMA-: SMA 50 Ohm End Launch Jack Receptacle - Round Contact Johnson Components Source: www.johnsoncomponents.com .. J502-ND.pdf; MF: JOHNSON COMPONENTS; MPN: 142-0701-801; OC_FARNELL: 1608592; OC_NEWARK: 90F2624
X23 X24 = X-ECS-TXO-TCXO:ECS-TXO-3225: HCMOS TCXO